# Altium project Lights Board.PrjPcb
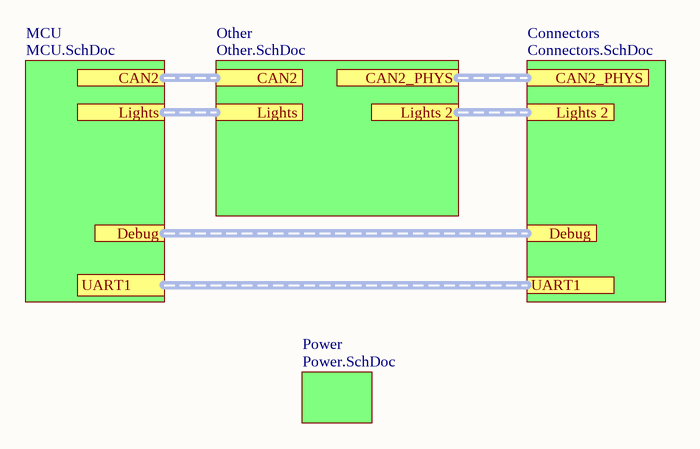
[diagram p0: Main.SchDoc]
5 sheets, 56 parts. Net scope: flat (ports and power ports of the same name join across sheets).
Board file: Lights Board.PcbDoc
Sheets:
  Main.SchDoc
    MCU = MCU.SchDoc
    Connectors = Connectors.SchDoc
    Other = Other.SchDoc
    Power = Power.SchDoc

## Sheet Main.SchDoc
size A4

### Sub-sheets
Connectors = Connectors.SchDoc: no entries
MCU = MCU.SchDoc: no entries
Other = Other.SchDoc: no entries
Power = Power.SchDoc: no entries

### Ports
CAN2 (harness CAN), CAN2_PHYS (harness CAN_PHYS), Debug (harness Debug), Lights 2 (harness Light Control Signals), Lights (harness Light Control Signals), UART1 (harness UART)

## Sheet MCU.SchDoc
size A4
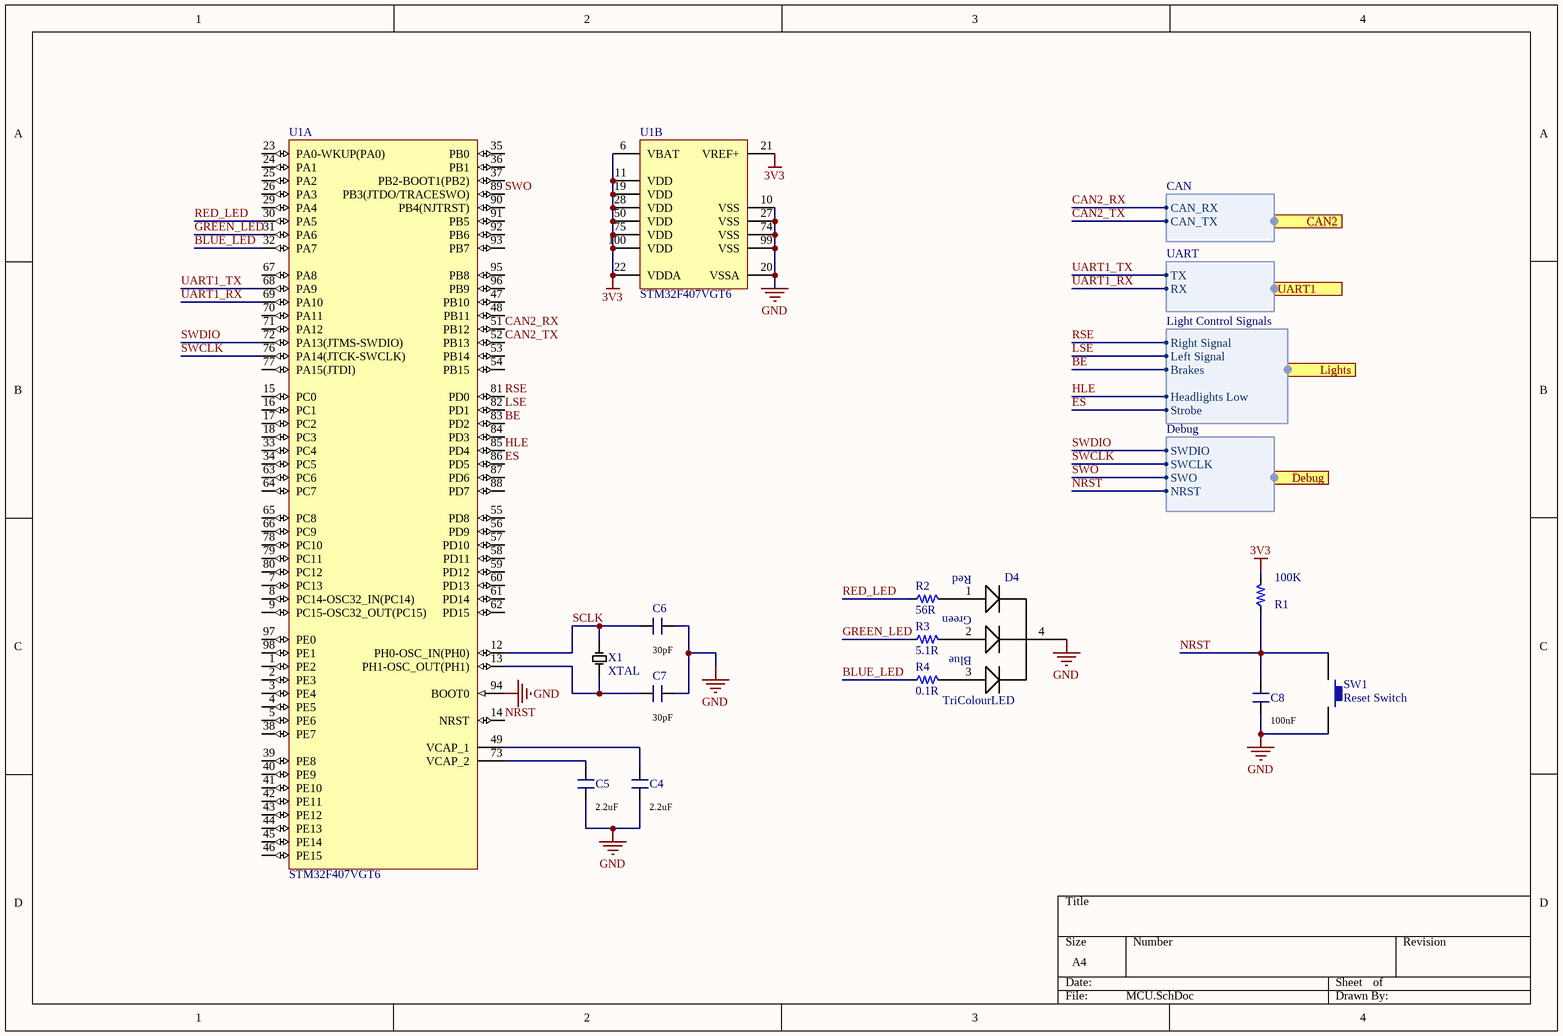
[diagram p1: MCU.SchDoc]

### Parts
C4  Capacitance: 2.2uF  [PCB_GENERIC_SMD_0603]  (hidden comment: SCH_GENERIC_CAPACITOR_0603)
C5  Capacitance: 2.2uF  [PCB_GENERIC_SMD_0603]  (hidden comment: SCH_GENERIC_CAPACITOR_0603)
C6  Capacitance: 30pF  [PCB_GENERIC_SMD_0603]  (hidden comment: SCH_GENERIC_CAPACITOR_0603)
C7  Capacitance: 30pF  [PCB_GENERIC_SMD_0603]  (hidden comment: SCH_GENERIC_CAPACITOR_0603)
C8  Capacitance: 100nF  [PCB_GENERIC_SMD_0603]  (hidden comment: SCH_GENERIC_CAPACITOR_0603)
D4  TriColourLED  [TricolourLED - SunLED - DK  1497-1225-2-ND]
R1  Resistance: 100K  [PCB_GENERIC_SMD_0603]  (hidden comment: SCH_GENERIC_RESISTOR_0603)
R2  Resistance: 56R  [PCB_GENERIC_SMD_0603]  (hidden comment: SCH_GENERIC_RESISTOR_0603)
R3  Resistance: 5.1R  [PCB_GENERIC_SMD_0603]  (hidden comment: SCH_GENERIC_RESISTOR_0603)
R4  Resistance: 0.1R  [PCB_GENERIC_SMD_0603]  (hidden comment: SCH_GENERIC_RESISTOR_0603)
SW1  Reset Switch  [Push Button Switch]
U1  STM32F407VGT6  [STM-LQFP100_M]  (parts A,B of 2)
X1  XTAL  [CRYSTAL_8MHZ]

### Ports
CAN2 (harness CAN), Debug (harness Debug), Lights (harness Light Control Signals), UART1 (harness UART)

### Harnesses
Debug: SWDIO, SWCLK, SWO, NRST
CAN: CAN_RX, CAN_TX
UART: TX, RX
Light Control Signals: Right Signal, Left Signal, Brakes, Headlights Low, Strobe

### Nets
3V3: R1.2 U1.6(VBAT) U1.11(VDD) U1.19(VDD) U1.21(VREF+) U1.22(VDDA) U1.28(VDD) U1.50(VDD) U1.75(VDD) U1.100(VDD)
GND: C4.1 C5.1 C6.1 C7.1 C8.2 D4.4 SW1.2 U1.10(VSS) U1.20(VSSA) U1.27(VSS) U1.74(VSS) U1.94(BOOT0) U1.99(VSS)
BE: U1.83(PD2) ; port Lights.Brakes
BLUE_LED: R4.1 U1.32(PA7)
CAN2_RX: U1.51(PB12) ; port CAN2.CAN_RX
CAN2_TX: U1.52(PB13) ; port CAN2.CAN_TX
ES: U1.86(PD5) ; port Lights.Strobe
GREEN_LED: R3.1 U1.31(PA6)
HLE: U1.85(PD4) ; port Lights.Headlights Low
LSE: U1.82(PD1) ; port Lights.Left Signal
NRST: C8.1 R1.1 SW1.1 U1.14(NRST) ; port Debug.NRST
RED_LED: R2.1 U1.30(PA5)
RSE: U1.81(PD0) ; port Lights.Right Signal
SCLK: C6.2 U1.12(PH0-OSC_IN(PH0)) X1.1
SWCLK: U1.76(PA14(JTCK-SWCLK)) ; port Debug.SWCLK
SWDIO: U1.72(PA13(JTMS-SWDIO)) ; port Debug.SWDIO
SWO: U1.89(PB3(JTDO/TRACESWO)) ; port Debug.SWO
UART1_RX: U1.69(PA10) ; port UART1.RX
UART1_TX: U1.68(PA9) ; port UART1.TX
NetC4_2: C4.2 U1.49(VCAP_1)
NetC5_2: C5.2 U1.73(VCAP_2)
NetC7_2: C7.2 U1.13(PH1-OSC_OUT(PH1)) X1.2
NetD4_1: D4.1(Red) R2.2
NetD4_2: D4.2(Green) R3.2
NetD4_3: D4.3(Blue) R4.2

Not connected (* = marked no-connect by the designer): U1 1(PE2) 2(PE3) 3(PE4) 4(PE5) 5(PE6) 7(PC13) 8(PC14-OSC32_IN(PC14)) 9(PC15-OSC32_OUT(PC15)) 15(PC0) 16(PC1) 17(PC2) 18(PC3) 23(PA0-WKUP(PA0)) 24(PA1) 25(PA2) 26(PA3) 29(PA4) 33(PC4) 34(PC5) 35(PB0) 36(PB1) 37(PB2-BOOT1(PB2)) 38(PE7) 39(PE8) 40(PE9) 41(PE10) 42(PE11) 43(PE12) 44(PE13) 45(PE14) 46(PE15) 47(PB10) 48(PB11) 53(PB14) 54(PB15) 55(PD8) 56(PD9) 57(PD10) 58(PD11) 59(PD12) 60(PD13) 61(PD14) 62(PD15) 63(PC6) 64(PC7) 65(PC8) 66(PC9) 67(PA8) 70(PA11) 71(PA12) 77(PA15(JTDI)) 78(PC10) 79(PC11) 80(PC12) 84(PD3) 87(PD6) 88(PD7) 90(PB4(NJTRST)) 91(PB5) 92(PB6) 93(PB7) 95(PB8) 96(PB9) 97(PE0) 98(PE1)

### Library data of the parts
C4-C8 = SCH_GENERIC_CAPACITOR_0603: Generic SMD capacitor 0603; Tolerance: *%
R1-R4 = SCH_GENERIC_RESISTOR_0603: Generic SMD resistor 0603
SW1 = PushButtonSwitch
U1 = STM32F407VGT6: ARM Cortex-M4 32-bit MCU+FPU, 210 DMIPS, 1024 kB Flash, 192 kB Internal RAM, 82 I/Os, 100-pin LQFP, -40 to 85 degC, Tray; Manufacturer: STMicroelectronics; D/A Converter: 2x12-bit; FLASH Size (Prog) (kB): 1024; I/Os (High Current): 82; Internal RAM Size (kB): 192; Operating Frequency(F) (Processor speed) (MHz): 168; Supply Voltage(Vcc) max (V): 3.6; Supply Voltage(Vcc) min (V): 1.8; DatasheetVersion: Rev. 4; PackageVersion: Rev. 1, 06/2013; PackageReference: LQFP100; PackageDescription: 100-Pin Low Profile Quad Flat Package, 14 x 14 mm Body, 0.5 mm Pitch; Supplier 1: Digi-Key; Supplier Part Number 1: 497-11605-ND; Supplier 2: Farnell; Supplier Part Number 2: 2064368; Supplier 3: Newark; Supplier Part Number 3: 73T2333; Supplier 4: Mouser; Supplier Part Number 4: 511-STM32F407VGT6; Core: ARM Cortex-M4; Packing: Tray; Mounting Technology: Surface Mount; PartNumber: STM32F407VGT6; ComponentLink1Description: Manufacturer URL; ComponentLink1URL: http://www.st.com/web/en/home.html; ComponentLink2Description: Datasheet; ComponentLink2URL: http://www.st.com/st-web-ui/static/active/en/resource/technical/document/datasheet/DM00037051.pdf; ComponentLink3Description: Package Specification; ComponentLink3URL: http://www.st.com/st-web-ui/static/active/en/resource/technical/document/data_brief/DM00071938.pdf
X1 = Crystal: Frequency: 8MHz

## Sheet Connectors.SchDoc
size A4
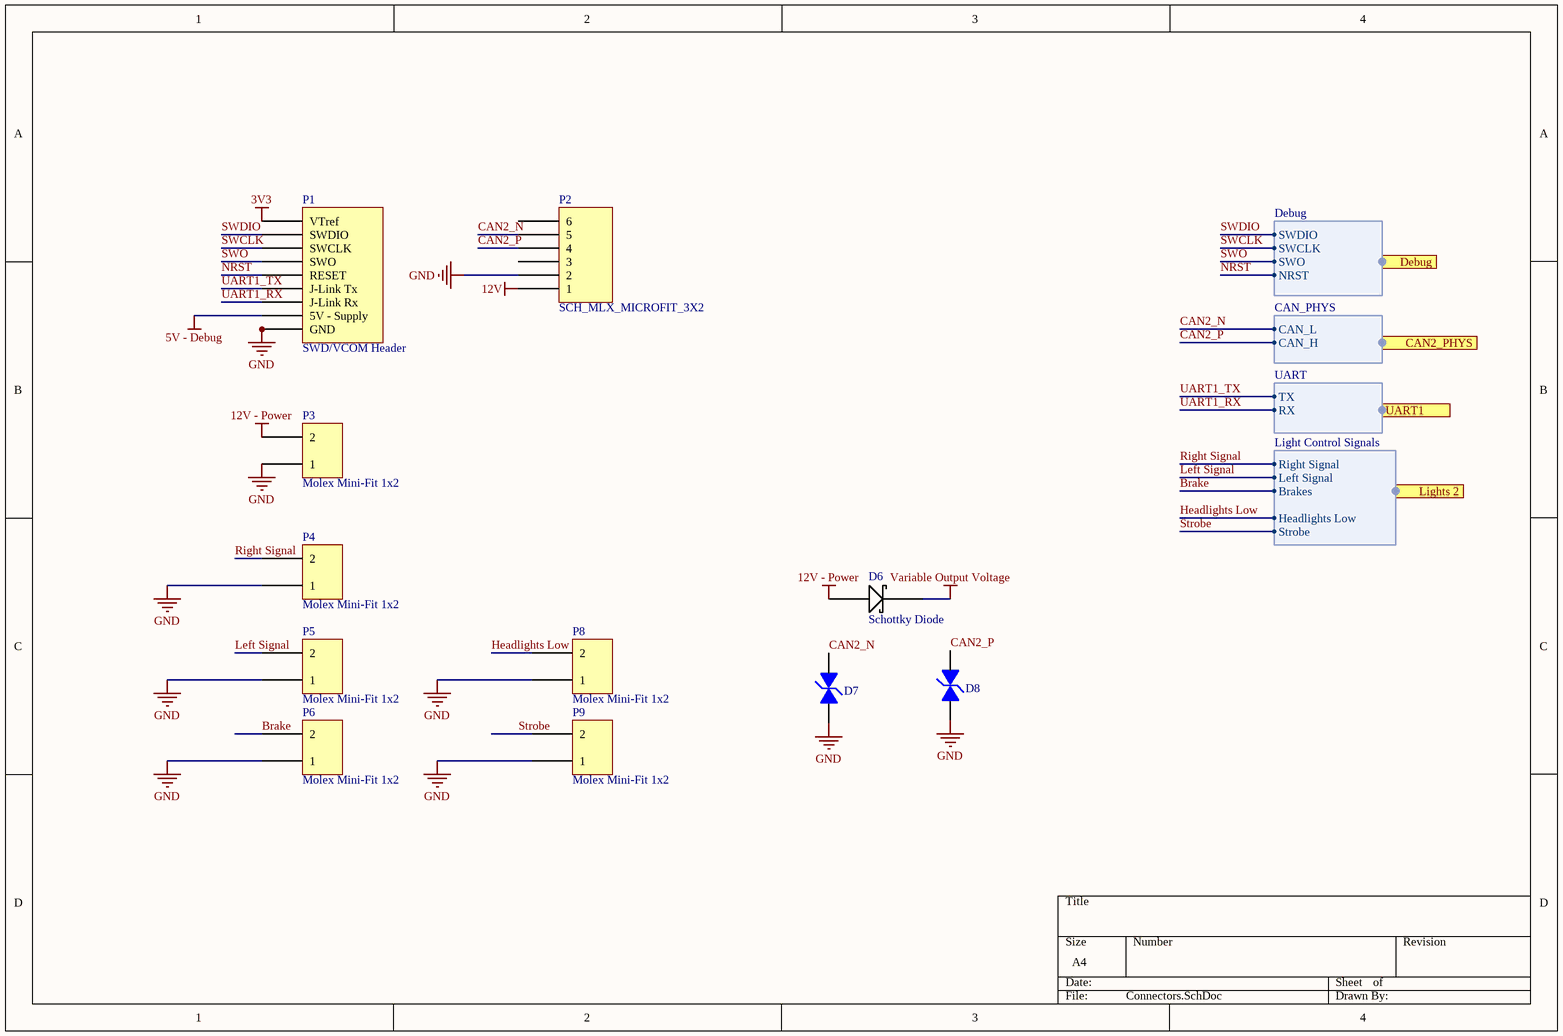
[diagram p2: Connectors.SchDoc]

### Parts
D6  Schottky Diode  [ON Semi Schottky Diode - MBRM110LT1G]
D7  TVS Diode  [TVS Diode]  (value not drawn)
D8  TVS Diode  [TVS Diode]  (value not drawn)
P1  SWD/VCOM Header  [Samtec TST-110-01-G-D]
P2  SCH_MLX_MICROFIT_3X2  [PCB_MLX_MICROFIT_3X2]
P3  Molex Mini-Fit 1x2  [Molex Mini-Fit Jr 2x1]
P4  Molex Mini-Fit 1x2  [Molex Mini-Fit Jr 2x1]
P5  Molex Mini-Fit 1x2  [Molex Mini-Fit Jr 2x1]
P6  Molex Mini-Fit 1x2  [Molex Mini-Fit Jr 2x1]
P8  Molex Mini-Fit 1x2  [Molex Mini-Fit Jr 2x1]
P9  Molex Mini-Fit 1x2  [Molex Mini-Fit Jr 2x1]

### Ports
CAN2_PHYS (harness CAN_PHYS), Debug (harness Debug), Lights 2 (harness Light Control Signals), UART1 (harness UART)

### Harnesses
Debug: SWDIO, SWCLK, SWO, NRST
CAN_PHYS: CAN_L, CAN_H
UART: TX, RX
Light Control Signals: Right Signal, Left Signal, Brakes, Headlights Low, Strobe

### Nets
3V3: P1.1(VTref)
5V - Debug: P1.19(5V_-_Supply)
12V: P2.1
12V - Power: D6.2 P3.2
GND: D7.2 D8.2 P1.4(GND) P1.6(GND) P1.8(GND) P1.10(GND) P1.12(GND) P2.2 P3.1 P4.1 P5.1 P6.1 P8.1 P9.1
Variable Output Voltage: D6.1
Brake: P6.2 ; port Lights 2.Brakes
CAN2_N: D7.1 P2.5 ; port CAN2_PHYS.CAN_L
CAN2_P: D8.1 P2.4 ; port CAN2_PHYS.CAN_H
Headlights Low: P8.2 ; port Lights 2.Headlights Low
Left Signal: P5.2 ; port Lights 2.Left Signal
NRST: P1.15(RESET) ; port Debug.NRST
Right Signal: P4.2 ; port Lights 2.Right Signal
Strobe: P9.2 ; port Lights 2.Strobe
SWCLK: P1.9(SWCLK) ; port Debug.SWCLK
SWDIO: P1.7(SWDIO) ; port Debug.SWDIO
SWO: P1.13(SWO) ; port Debug.SWO
UART1_RX: P1.17(J-Link_Rx) ; port UART1.RX
UART1_TX: P1.5(J-Link_Tx) ; port UART1.TX

Not connected (* = marked no-connect by the designer): P2 3 6

### Library data of the parts
D6 = ON Semi Schottky Diode - MBRM110LT1G
D7 D8 = TVS Diode: Manufacturer: Bourns; Manufacturer ID: CDSOD323-T03SC

## Sheet Other.SchDoc
size A4
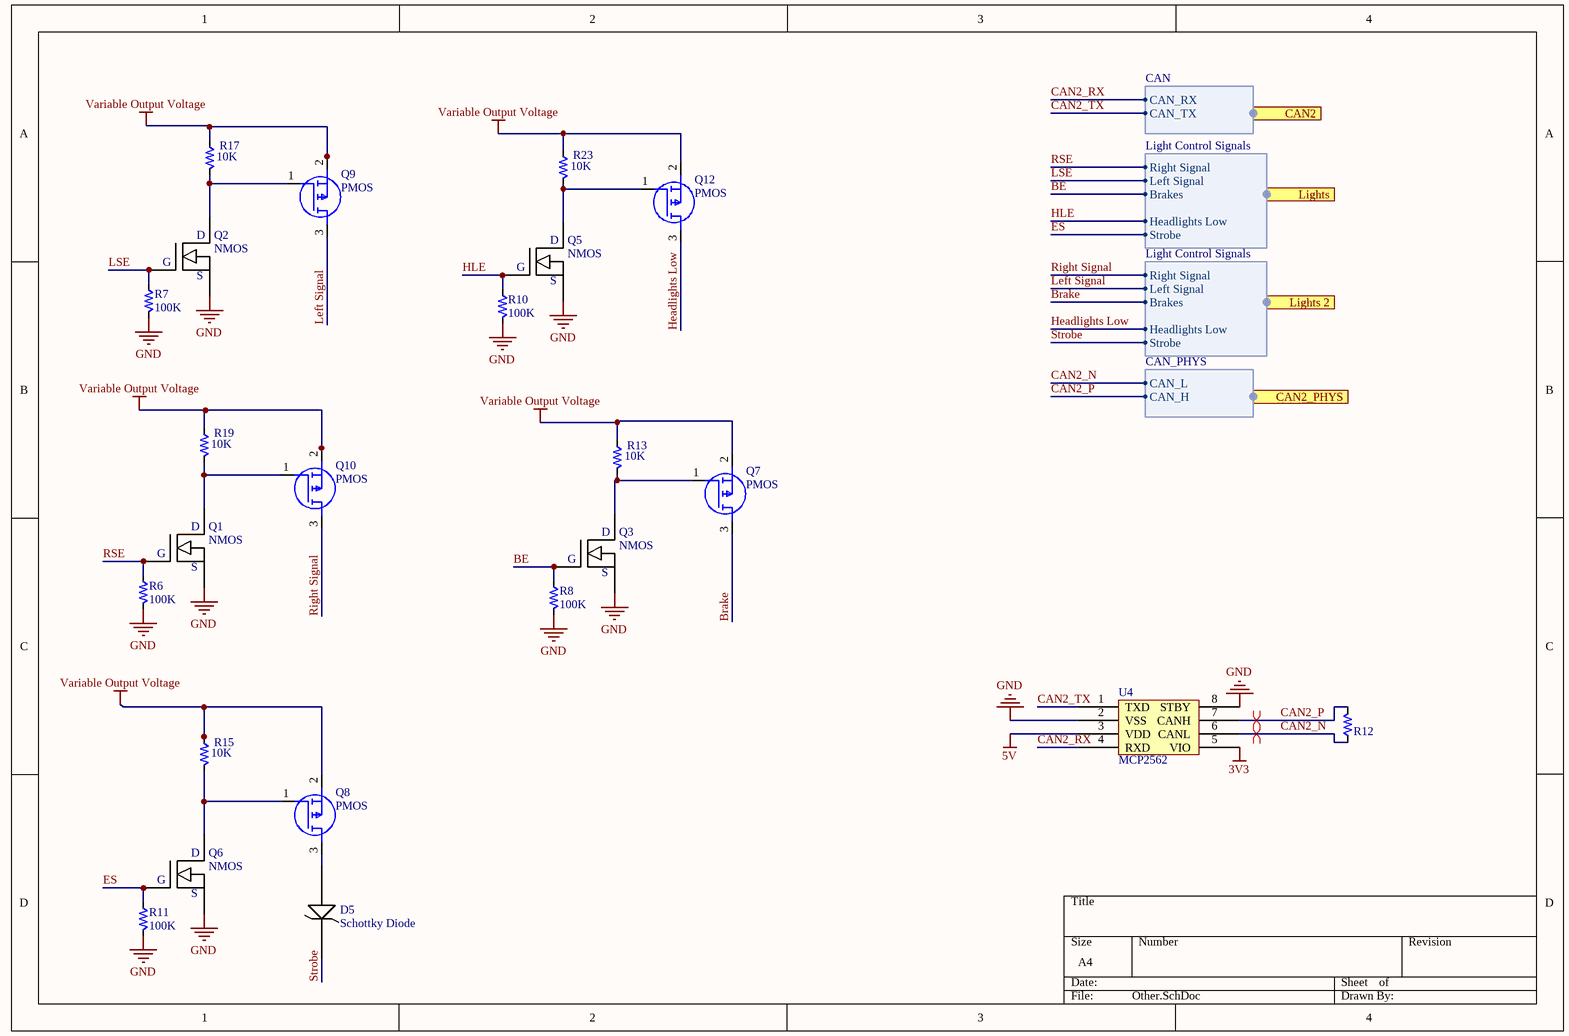
[diagram p3: Other.SchDoc]

### Parts
D5  Schottky Diode  [ON Semi Schottky Diode - MBRM110LT1G]
Q1  NMOS  [NMOS - SSM3K333R - SOTFL95P180X88-3M]
Q2  NMOS  [NMOS - SSM3K333R - SOTFL95P180X88-3M]
Q3  NMOS  [NMOS - SSM3K333R - SOTFL95P180X88-3M]
Q5  NMOS  [NMOS - SSM3K333R - SOTFL95P180X88-3M]
Q6  NMOS  [NMOS - SSM3K333R - SOTFL95P180X88-3M]
Q7  PMOS  [NMOS - SSM3K333R - SOTFL95P180X88-3M]
Q8  PMOS  [NMOS - SSM3K333R - SOTFL95P180X88-3M]
Q9  PMOS  [NMOS - SSM3K333R - SOTFL95P180X88-3M]
Q10  PMOS  [NMOS - SSM3K333R - SOTFL95P180X88-3M]
Q12  PMOS  [NMOS - SSM3K333R - SOTFL95P180X88-3M]
R6  Resistance: 100K  [PCB_GENERIC_SMD_0603]  (hidden comment: SCH_GENERIC_RESISTOR_0603)
R7  Resistance: 100K  [PCB_GENERIC_SMD_0603]  (hidden comment: SCH_GENERIC_RESISTOR_0603)
R8  Resistance: 100K  [PCB_GENERIC_SMD_0603]  (hidden comment: SCH_GENERIC_RESISTOR_0603)
R10  Resistance: 100K  [PCB_GENERIC_SMD_0603]  (hidden comment: SCH_GENERIC_RESISTOR_0603)
R11  Resistance: 100K  [PCB_GENERIC_SMD_0603]  (hidden comment: SCH_GENERIC_RESISTOR_0603)
R12  SCH_GENERIC_RESISTOR_0603  [PCB_GENERIC_SMD_0603]  (value not drawn)
R13  Resistance: 10K  [PCB_GENERIC_SMD_0603]  (hidden comment: SCH_GENERIC_RESISTOR_0603)
R15  Resistance: 10K  [PCB_GENERIC_SMD_0603]  (hidden comment: SCH_GENERIC_RESISTOR_0603)
R17  Resistance: 10K  [PCB_GENERIC_SMD_0603]  (hidden comment: SCH_GENERIC_RESISTOR_0603)
R19  Resistance: 10K  [PCB_GENERIC_SMD_0603]  (hidden comment: SCH_GENERIC_RESISTOR_0603)
R23  Resistance: 10K  [PCB_GENERIC_SMD_0603]  (hidden comment: SCH_GENERIC_RESISTOR_0603)
U4  MCP2562  [MCP2562]

### Ports
CAN2 (harness CAN), CAN2_PHYS (harness CAN_PHYS), Lights 2 (harness Light Control Signals), Lights (harness Light Control Signals)

### Harnesses
CAN_PHYS: CAN_L, CAN_H
CAN: CAN_RX, CAN_TX
Light Control Signals: Right Signal, Left Signal, Brakes, Headlights Low, Strobe

### Nets
3V3: U4.5(VIO)
5V: U4.3(VDD)
GND: Q1.2(S) Q2.2(S) Q3.2(S) Q5.2(S) Q6.2(S) R6.2 R7.2 R8.2 R10.2 R11.2 U4.2(VSS) U4.8(STBY)
Variable Output Voltage: Q7.2 Q8.2 Q9.2 Q10.2 Q12.2 R13.1 R15.1 R17.1 R19.1 R23.1
BE: Q3.1(G) R8.1 ; port Lights.Brakes
Brake: Q7.3 ; port Lights 2.Brakes
CAN2_N: R12.1 U4.6(CANL) ; port CAN2_PHYS.CAN_L
CAN2_P: R12.2 U4.7(CANH) ; port CAN2_PHYS.CAN_H
CAN2_RX: U4.4(RXD) ; port CAN2.CAN_RX
CAN2_TX: U4.1(TXD) ; port CAN2.CAN_TX
ES: Q6.1(G) R11.1 ; port Lights.Strobe
Headlights Low: Q12.3 ; port Lights 2.Headlights Low
HLE: Q5.1(G) R10.1 ; port Lights.Headlights Low
Left Signal: Q9.3 ; port Lights 2.Left Signal
LSE: Q2.1(G) R7.1 ; port Lights.Left Signal
Right Signal: Q10.3 ; port Lights 2.Right Signal
RSE: Q1.1(G) R6.1 ; port Lights.Right Signal
Strobe: D5.1 ; port Lights 2.Strobe
NetD5_2: D5.2 Q8.3
NetQ1_3: Q1.3(D) Q10.1 R19.2
NetQ2_3: Q2.3(D) Q9.1 R17.2
NetQ3_3: Q3.3(D) Q7.1 R13.2
NetQ5_3: Q5.3(D) Q12.1 R23.2
NetQ6_3: Q6.3(D) Q8.1 R15.2

### Layout directives
differential pair: CAN2_N, CAN2_P

### Library data of the parts
D5 = ON Semi Schottky Diode - MBRM110LT1G
Q1-Q3 Q5 Q6 = NMOS - SSM3K333R
Q7-Q10 Q12 = SSM3J334R,LF(T: MOSFET (P-Channel); Manufacturer_Name: Toshiba; Datasheet Link: http://toshiba.semicon-storage.com/info/docget.jsp?did=5579&prodName=SSM3J334R; Height: 0.88mm; Manufacturer_Part_Number: SSM3J334R,LF(T; RS Part Number: 1445260P; RS Price/Stock: http://uk.rs-online.com/web/p/products/1445260P
R6-R8 R10-R13 R15 R17 R19 R23 = SCH_GENERIC_RESISTOR_0603: Generic SMD resistor 0603

## Sheet Power.SchDoc
size A4
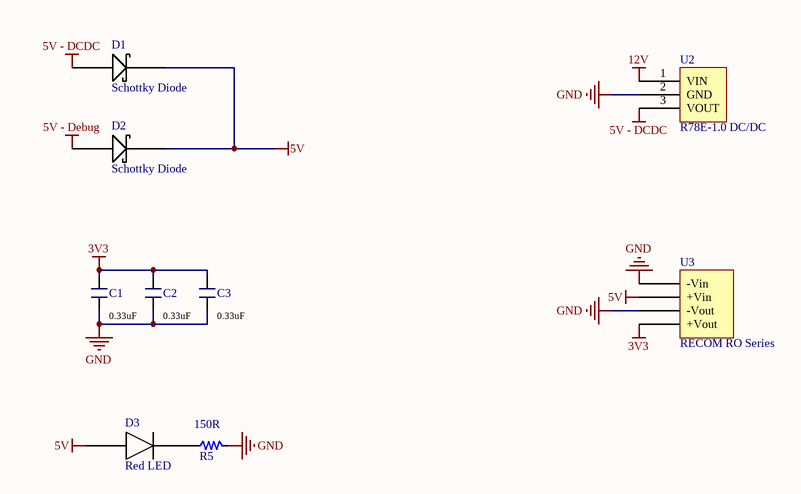
[diagram p4: Power.SchDoc]

### Parts
C1  Capacitance: 0.33uF  [PCB_GENERIC_SMD_0603]  (hidden comment: SCH_GENERIC_CAPACITOR_0603)
C2  Capacitance: 0.33uF  [PCB_GENERIC_SMD_0603]  (hidden comment: SCH_GENERIC_CAPACITOR_0603)
C3  Capacitance: 0.33uF  [PCB_GENERIC_SMD_0603]  (hidden comment: SCH_GENERIC_CAPACITOR_0603)
D1  Schottky Diode  [ON Semi Schottky Diode - MBRM110LT1G]
D2  Schottky Diode  [ON Semi Schottky Diode - MBRM110LT1G]
D3  Red LED  [SMD_0603_LED]
R5  Resistance: 150R  [PCB_GENERIC_SMD_0603]  (hidden comment: SCH_GENERIC_RESISTOR_0603)
U2  R78E-1.0 DC/DC  [R78-1.0]
U3  RECOM RO Series  [RECOM RO Series 1W DCDC]

### Nets
3V3: C1.2 C2.2 C3.2 U3.4(+Vout)
5V: D1.1 D2.1 D3.1 U3.2(+Vin)
5V - DCDC: D1.2 U2.3(VOUT)
5V - Debug: D2.2
12V: U2.1(VIN)
GND: C1.1 C2.1 C3.1 R5.2 U2.2(GND) U3.1(-Vin) U3.3(-Vout)
NetD3_2: D3.2 R5.1

### Library data of the parts
C1 = SCH_GENERIC_CAPACITOR_0603: Generic SMD capacitor 0603
C2 C3 = SCH_GENERIC_CAPACITOR_0603: as C4 on sheet MCU
D1 D2 = ON Semi Schottky Diode - MBRM110LT1G
D3 = SMD_0603_LED
R5 = SCH_GENERIC_RESISTOR_0603: Generic SMD resistor 0603
U2 = R78E-1.0
U3 = RECOM RO Series DCDC Converter

## Nets that join several sheets
3V3: MCU (10 pins), Connectors (P1.1), Other (U4.5), Power (C1.2 C2.2 C3.2 U3.4)
5V: Other (U4.3), Power (D1.1 D2.1 D3.1 U3.2)
5V - Debug: Connectors (P1.19), Power (D2.2)
12V: Connectors (P2.1), Power (U2.1)
GND: MCU (13 pins), Connectors (14 pins), Other (12 pins), Power (7 pins)
Variable Output Voltage: Connectors (D6.1), Other (10 pins)
BE: MCU (U1.83), Other (Q3.1 R8.1)
Brake: Connectors (P6.2), Other (Q7.3)
CAN2_N: Connectors (D7.1 P2.5), Other (R12.1 U4.6)
CAN2_P: Connectors (D8.1 P2.4), Other (R12.2 U4.7)
CAN2_RX: MCU (U1.51), Other (U4.4)
CAN2_TX: MCU (U1.52), Other (U4.1)
ES: MCU (U1.86), Other (Q6.1 R11.1)
Headlights Low: Connectors (P8.2), Other (Q12.3)
HLE: MCU (U1.85), Other (Q5.1 R10.1)
Left Signal: Connectors (P5.2), Other (Q9.3)
LSE: MCU (U1.82), Other (Q2.1 R7.1)
NRST: MCU (C8.1 R1.1 SW1.1 U1.14), Connectors (P1.15)
Right Signal: Connectors (P4.2), Other (Q10.3)
RSE: MCU (U1.81), Other (Q1.1 R6.1)
Strobe: Connectors (P9.2), Other (D5.1)
SWCLK: MCU (U1.76), Connectors (P1.9)
SWDIO: MCU (U1.72), Connectors (P1.7)
SWO: MCU (U1.89), Connectors (P1.13)
UART1_RX: MCU (U1.69), Connectors (P1.17)
UART1_TX: MCU (U1.68), Connectors (P1.5)